# Altium schematic sheet Reid Orthotic v2 IO.SchDoc: CAL1020 IO
size A4; DrawnBy: Alex Gilmour; DocumentNumber: 2; Revision: v2; SheetNumber: 2; SheetTotal: 5; PageSetup: Record=PageOptions|CenterHorizontal=True|CenterVertical=True|PrintScale=0.73|XCorrection=1.00|YCorrection=1.00|PrintKind=0|BorderSize=5000000|LeftOffset=0|BottomOffset=0|Orientation=2|PaperLength=1000|PaperWidth=1000|Scale=100|PaperSource=7|PrintQuality=-3|MediaType=1|DitherType=10|PrintScaleMode=1|PaperKind=A4|PaperIndex=9
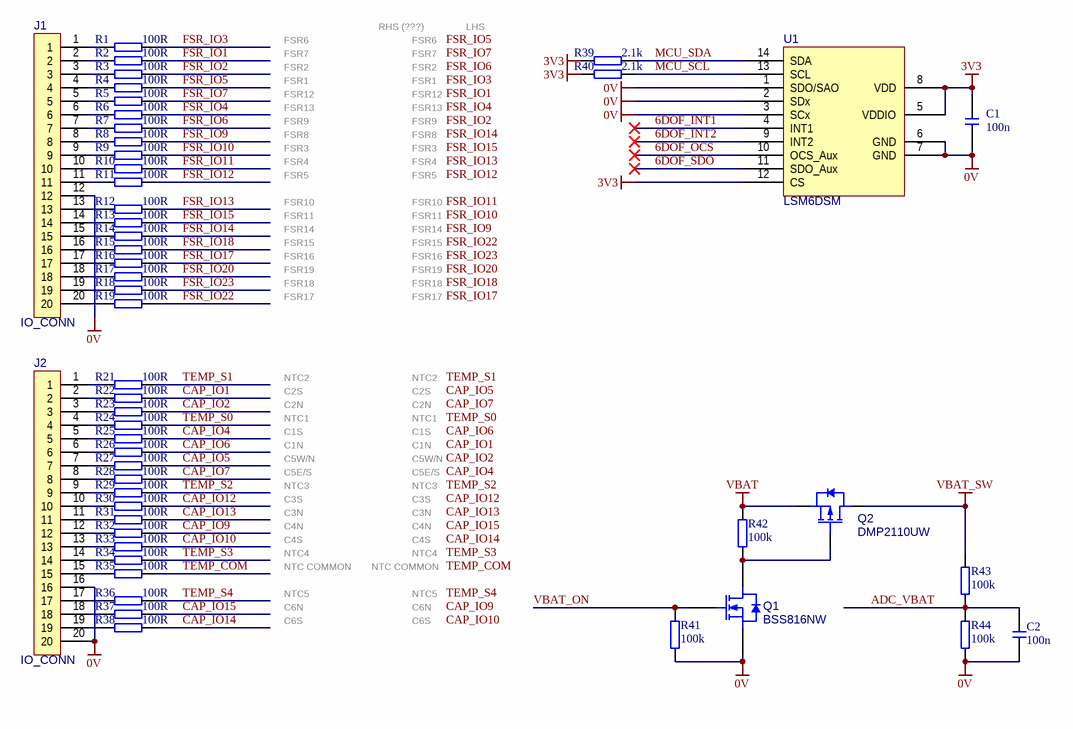
[diagram p0: Reid Orthotic v2 IO.SchDoc]

## Parts
C1  100n  [0402 CAP HD]
C2  100n  [0402 CAP HD]
J1  IO_CONN  [IO_CONN]
J2  IO_CONN  [IO_CONN]
Q1  BSS816NW  [SOT323]
Q2  DMP2110UW  [SOT323]
R1  100R  [0402 RES HD]
R2  100R  [0402 RES HD]
R3  100R  [0402 RES HD]
R4  100R  [0402 RES HD]
R5  100R  [0402 RES HD]
R6  100R  [0402 RES HD]
R7  100R  [0402 RES HD]
R8  100R  [0402 RES HD]
R9  100R  [0402 RES HD]
R10  100R  [0402 RES HD]
R11  100R  [0402 RES HD]
R12  100R  [0402 RES HD]
R13  100R  [0402 RES HD]
R14  100R  [0402 RES HD]
R15  100R  [0402 RES HD]
R16  100R  [0402 RES HD]
R17  100R  [0402 RES HD]
R18  100R  [0402 RES HD]
R19  100R  [0402 RES HD]
R21  100R  [0402 RES HD]
R22  100R  [0402 RES HD]
R23  100R  [0402 RES HD]
R24  100R  [0402 RES HD]
R25  100R  [0402 RES HD]
R26  100R  [0402 RES HD]
R27  100R  [0402 RES HD]
R28  100R  [0402 RES HD]
R29  100R  [0402 RES HD]
R30  100R  [0402 RES HD]
R31  100R  [0402 RES HD]
R32  100R  [0402 RES HD]
R33  100R  [0402 RES HD]
R34  100R  [0402 RES HD]
R35  100R  [0402 RES HD]
R36  100R  [0402 RES HD]
R37  100R  [0402 RES HD]
R38  100R  [0402 RES HD]
R39  2.1k  [0402 RES HD]
R40  2.1k  [0402 RES HD]
R41  100k  [0402 RES HD]
R42  100k  [0402 RES HD]
R43  100k  [0402 RES HD]
R44  100k  [0402 RES HD]
U1  LSM6DSM  [LSM6DSM]

## Nets
0V: C1.1 C2.2 J1.12 J2.16 J2.20 Q1.2(S) R41.2 R44.2 U1.1(SDO/SAO) U1.2(SDx) U1.3(SCx) U1.6(GND) U1.7(GND)
3V3: C1.2 R39.2 R40.2 U1.5(VDDIO) U1.8(VDD) U1.12(CS)
VBAT: Q2.2(S) R42.1
VBAT_SW: Q2.3(D) R43.1
6DOF_INT1: U1.4(INT1)
6DOF_INT2: U1.9(INT2)
6DOF_OCS: U1.10(OCS_Aux)
6DOF_SDO: U1.11(SDO_Aux)
ADC_VBAT: C2.1 R43.2 R44.1
CAP_IO1: R22.1
CAP_IO2: R23.1
CAP_IO4: R25.1
CAP_IO5: R27.1
CAP_IO6: R26.1
CAP_IO7: R28.1
CAP_IO9: R32.1
CAP_IO10: R33.1
CAP_IO12: R30.1
CAP_IO13: R31.1
CAP_IO14: R38.1
CAP_IO15: R37.1
FSR_IO1: R2.1
FSR_IO2: R3.1
FSR_IO3: R1.1
FSR_IO4: R6.1
FSR_IO5: R4.1
FSR_IO6: R7.1
FSR_IO7: R5.1
FSR_IO9: R8.1
FSR_IO10: R9.1
FSR_IO11: R10.1
FSR_IO12: R11.1
FSR_IO13: R12.1
FSR_IO14: R14.1
FSR_IO15: R13.1
FSR_IO17: R16.1
FSR_IO18: R15.1
FSR_IO20: R17.1
FSR_IO22: R19.1
FSR_IO23: R18.1
MCU_SCL: R40.1 U1.13(SCL)
MCU_SDA: R39.1 U1.14(SDA)
TEMP_COM: R35.1
TEMP_S0: R24.1
TEMP_S1: R21.1
TEMP_S2: R29.1
TEMP_S3: R34.1
TEMP_S4: R36.1
VBAT_ON: Q1.1(G) R41.1
NetJ1_1: J1.1 R1.2
NetJ1_2: J1.2 R2.2
NetJ1_3: J1.3 R3.2
NetJ1_4: J1.4 R4.2
NetJ1_5: J1.5 R5.2
NetJ1_6: J1.6 R6.2
NetJ1_7: J1.7 R7.2
NetJ1_8: J1.8 R8.2
NetJ1_9: J1.9 R9.2
NetJ1_10: J1.10 R10.2
NetJ1_11: J1.11 R11.2
NetJ1_13: J1.13 R12.2
NetJ1_14: J1.14 R13.2
NetJ1_15: J1.15 R14.2
NetJ1_16: J1.16 R15.2
NetJ1_17: J1.17 R16.2
NetJ1_18: J1.18 R17.2
NetJ1_19: J1.19 R18.2
NetJ1_20: J1.20 R19.2
NetJ2_1: J2.1 R21.2
NetJ2_2: J2.2 R22.2
NetJ2_3: J2.3 R23.2
NetJ2_4: J2.4 R24.2
NetJ2_5: J2.5 R25.2
NetJ2_6: J2.6 R26.2
NetJ2_7: J2.7 R27.2
NetJ2_8: J2.8 R28.2
NetJ2_9: J2.9 R29.2
NetJ2_10: J2.10 R30.2
NetJ2_11: J2.11 R31.2
NetJ2_12: J2.12 R32.2
NetJ2_13: J2.13 R33.2
NetJ2_14: J2.14 R34.2
NetJ2_15: J2.15 R35.2
NetJ2_17: J2.17 R36.2
NetJ2_18: J2.18 R37.2
NetJ2_19: J2.19 R38.2
NetQ1_3: Q1.3(D) Q2.1(G) R42.2

## Notes on the sheet
- FSR1
- FSR2
- FSR6
- FSR7
- RHS (???)
- LHS
- FSR3
- FSR8
- FSR9
- FSR12
- FSR13
- FSR4
- FSR5
- FSR10
- FSR11
- FSR14
- FSR15
- FSR16
- FSR18
- FSR19
- FSR17
- NTC1
- NTC2
- C2S
- C2N
- NTC3
- C1S
- C1N
- C5W/N
- C5E/S
- NTC4
- C3S
- C3N
- C4N
- C4S
- NTC5
- NTC COMMON
- C6N
- C6S
- Labels drawn without touching a wire or pin: CAP_IO1, CAP_IO2, CAP_IO4, CAP_IO5, CAP_IO6, CAP_IO7, CAP_IO9, CAP_IO10, CAP_IO12, CAP_IO13, CAP_IO14, CAP_IO15, FSR_IO1, FSR_IO2, FSR_IO3, FSR_IO4, FSR_IO5, FSR_IO6, FSR_IO7, FSR_IO9, FSR_IO10, FSR_IO11, FSR_IO12, FSR_IO13, FSR_IO14, FSR_IO15, FSR_IO17, FSR_IO18, FSR_IO20, FSR_IO22, FSR_IO23, TEMP_COM, TEMP_S0, TEMP_S1, TEMP_S2, TEMP_S3, TEMP_S4
- A.B.N. 89 367 394 425
- Revision
- Drawn by
- Last updated
- Sheet
- of

## Library data of the parts
C1 C2 = Capacitor
Q1 = MOSFET N-CH
Q2 = MOSFET PCH
R1-R19 R21-R44 = Resistor